# Altium schematic sheet 24V_Buck_3_3V.SchDoc
size A; SheetNumber: 9; SheetTotal: 10
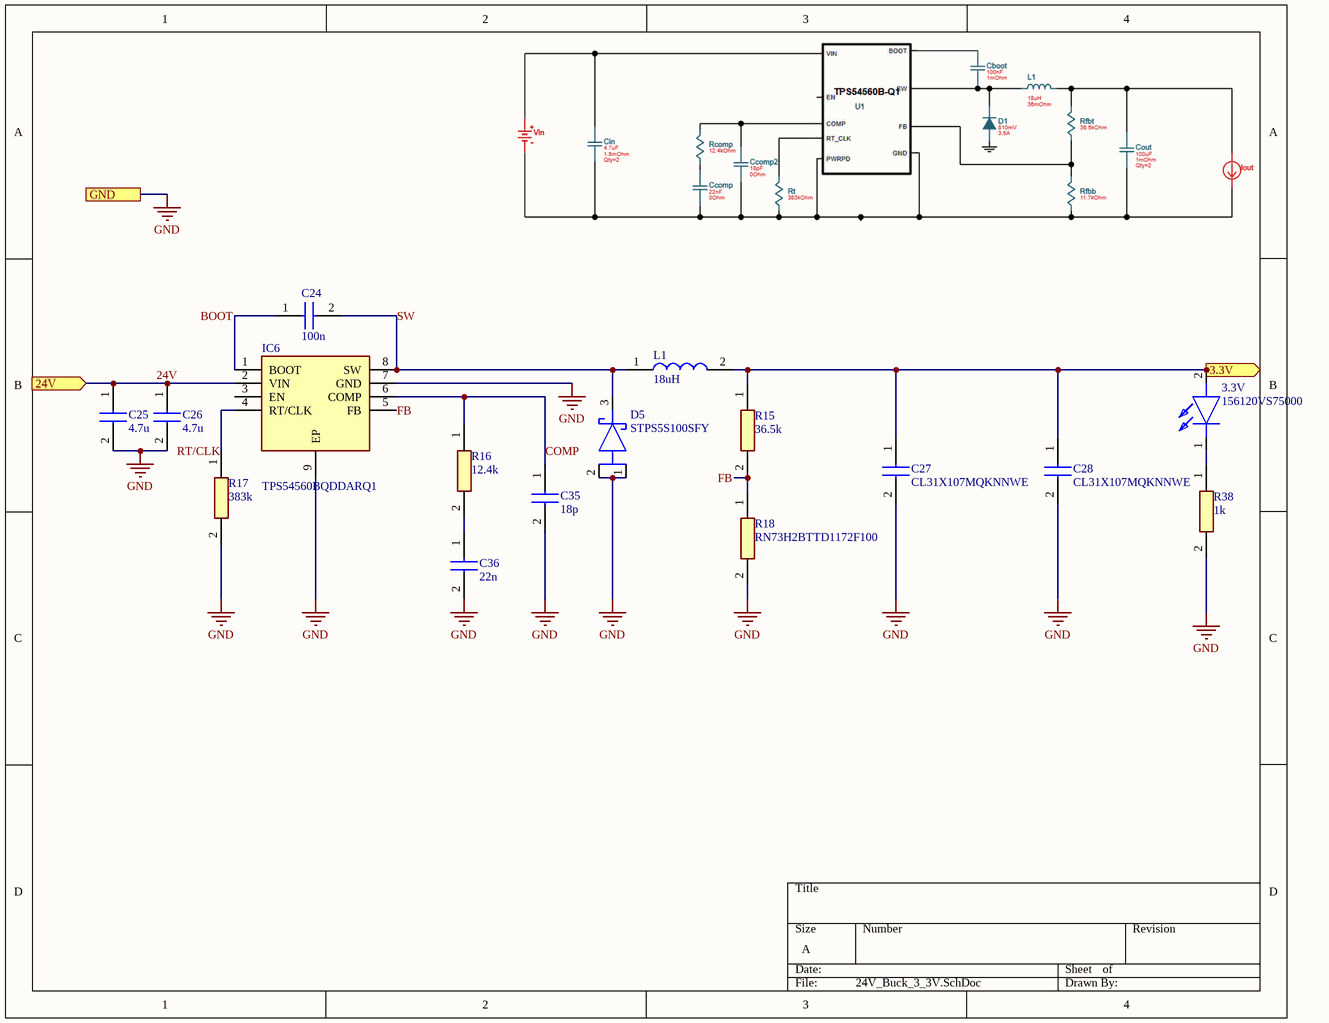
[diagram p0: 24V_Buck_3_3V.SchDoc]

## Parts
3.3V  156120VS75000  [156120VS75000]
C24  100n  [CAPC3216X94N]
C25  4.7u  [CAPC3216X180N]
C26  4.7u  [CAPC3216X180N]
C27  CL31X107MQKNNWE  [CAPC3216X190N]
C28  CL31X107MQKNNWE  [CAPC3216X190N]
C35  18p  [C1206]
C36  22n  [CAPC3216X170N]
D5  STPS5S100SFY  [STPS10L40CSF]
IC6  TPS54560BQDDARQ1  [SOIC127P600X170-9N]
L1  18uH  [INDPM125125X800N]
R15  36.5k  [RESC3116X65N]
R16  12.4k  [ERJUP6]
R17  383k  [RESC3216X70N]
R18  RN73H2BTTD1172F100  [RESC3216X70N]
R38  1k  [RESC3116X65N]

## Ports
3.3V (out), 24V (in), GND

## Nets
GND: C25.2 C26.2 C27.2 C28.2 C35.2 C36.2 D5.1(A1) D5.2(A2) IC6.7(GND) IC6.9(EP) R17.2 R18.2 R38.2 ; port GND
3.3V: 3.3V.2(A) C27.1 C28.1 L1.2 R15.1 ; port 3.3V
24V: C25.1 C26.1 IC6.2(VIN) ; port 24V
BOOT: C24.1 IC6.1(BOOT)
COMP: C35.1 IC6.6(COMP) R16.1
FB: IC6.5(FB) R15.2 R18.1
RT/CLK: IC6.4(RT/CLK) R17.1
SW: C24.2 D5.3(K) IC6.8(SW) L1.1
Net3.3V_1: 3.3V.1(K) R38.1
NetC36_1: C36.1 R16.2

Not connected (* = marked no-connect by the designer): IC6 3(EN)

## Library data of the parts
3.3V = 156120VS75000: LED; Manufacturer_Name: Wurth Elektronik; Datasheet Link: https://www.we-online.com/components/products/datasheet/156120VS75000.pdf; Height: 1.3mm; Manufacturer_Part_Number: 156120VS75000; Mouser Part Number: 710-156120VS75000; Mouser Price/Stock: https://www.mouser.co.uk/ProductDetail/Wurth-Elektronik/156120VS75000?qs=2kOmHSv6VfQAUFg5BeuEfQ%3D%3D
C24 = 12065C104J4Z2A: Capacitor; Manufacturer_Name: Kyocera AVX; Datasheet Link: https://spicat.kyocera-avx.com/product/mlcc/chartview/12065C104J4Z2A/DataSheet/X7R; Height: 0.94mm; Manufacturer_Part_Number: 12065C104J4Z2A; Mouser Part Number: 581-12065C104J4Z2A; Mouser Price/Stock: https://www.mouser.com/Search/Refine.aspx?Keyword=581-12065C104J4Z2A
C25 C26 = GMK316AB7475KLHT: Capacitor; Manufacturer_Name: TAIYO YUDEN; Datasheet Link: https://ds.yuden.co.jp/TYCOMPAS/ap/specSheet?pn=MMASG31LAB7475KTNA01; Height: 1.8mm; Manufacturer_Part_Number: GMK316AB7475KLHT; Mouser Part Number: 963-GMK316AB7475KLHT; Mouser Price/Stock: https://www.mouser.co.uk/ProductDetail/TAIYO-YUDEN/GMK316AB7475KLHT?qs=CNQs48zzdnoeKLJ9%2F6WNWQ%3D%3D; Arrow Part Number: GMK316AB7475KLHT; Arrow Price/Stock: https://www.arrow.com/en/products/gmk316ab7475klht/taiyo-yuden?utm_currency=USD&region=nac
C27 C28 = CL31X107MQKNNWE: Capacitor; Manufacturer_Name: SAMSUNG; Datasheet Link: https://www.digikey.sg/en/products/detail/samsung-electro-mechanics/CL31X107MQKNNWE/25854287?srsltid=AfmBOoqYZ52GRQ9Xlh8bi0lGOe-KtDJ1wz9-WyaigKcCVSEueXc8l4on; Height: 1.9mm; Manufacturer_Part_Number: CL31X107MQKNNWE; Mouser Part Number: 187-CL31X107MQKNNWE; Mouser Price/Stock: https://www.mouser.co.uk/ProductDetail/Samsung-Electro-Mechanics/CL31X107MQKNNWE?qs=Jm2GQyTW%2FbjTv%252BH%2F%252BndEuA%3D%3D
C35 = C1206C180FGGACTU: Capacitor; Manufacturer_Name: KEMET; Datasheet Link: https://content.kemet.com/datasheets/KEM_C1009_C0G_HV_SMD.pdf; Manufacturer_Part_Number: C1206C180FGGACTU
C36 = VJ1206Y223KXBAC: Capacitor; Manufacturer_Name: Vishay; Datasheet Link: http://www.vishay.com/docs/45200/vjhirelseries.pdf; Height: 1.7mm; Manufacturer_Part_Number: VJ1206Y223KXBAC; Mouser Part Number: 77-VJ1206Y223KXBAC; Mouser Price/Stock: https://www.mouser.co.uk/ProductDetail/Vishay-Vitramon/VJ1206Y223KXBAC?qs=DS7Z8uEdLNy5V8LiZ3YDHg%3D%3D
D5 = STPS5S100SFY: Schottky Diode with Dual Anode; Manufacturer_Name: STMicroelectronics; Datasheet Link: https://www.st.com/resource/en/datasheet/stps5s100sfy.pdf; Height: 1.2mm; Manufacturer_Part_Number: STPS5S100SFY; Mouser Part Number: 511-STPS5S100SFY; Mouser Price/Stock: https://www.mouser.co.uk/ProductDetail/STMicroelectronics/STPS5S100SFY?qs=IS%252B4QmGtzzqXirfVtJ7lSA%3D%3D
IC6 = TPS54560BQDDARQ1: Integrated Circuit; Manufacturer_Name: Texas Instruments; Datasheet Link: http://www.ti.com/lit/gpn/tps54560b-q1; Height: 1.7mm; Manufacturer_Part_Number: TPS54560BQDDARQ1; Mouser Part Number: 595-TPS54560BQDDARQ1; Mouser Price/Stock: https://www.mouser.co.uk/ProductDetail/Texas-Instruments/TPS54560BQDDARQ1?qs=Mv7BduZupUi0AsDfghsxzg%3D%3D; Arrow Part Number: TPS54560BQDDARQ1; Arrow Price/Stock: https://www.arrow.com/en/products/tps54560bqddarq1/texas-instruments?utm_currency=USD&region=nac
L1 = SRR1280-180M: Inductor; Manufacturer_Name: Bourns; Datasheet Link: https://www.bourns.com/docs/Product-Datasheets/SRR1280.pdf; Height: 8mm; Manufacturer_Part_Number: SRR1280-180M; Mouser Part Number: 652-SRR1280-180M; Mouser Price/Stock: https://www.mouser.co.uk/ProductDetail/Bourns/SRR1280-180M?qs=brMhP%2FMjUfeRcSm%2FRxSrFQ%3D%3D; Arrow Part Number: SRR1280-180M; Arrow Price/Stock: https://www.arrow.com/en/products/srr1280-180m/bourns?region=nac
R15 = CRCW120636K5FKEAHP: Resistor; Manufacturer_Name: Vishay; Height: 0.65mm; Manufacturer_Part_Number: CRCW120636K5FKEAHP; Mouser Part Number: 71-CRCW120636K5FKEAH; Mouser Price/Stock: https://www.mouser.co.uk/ProductDetail/Vishay-Dale/CRCW120636K5FKEAHP?qs=VAB4DzKv5wUp%2FbasZHay7w%3D%3D; Arrow Part Number: CRCW120636K5FKEAHP; Arrow Price/Stock: https://www.arrow.com/en/products/crcw120636k5fkeahp/vishay?region=nac
R16 = ERJ-UP6F1242V: Resistor; Manufacturer_Name: Panasonic; Datasheet Link: https://industrial.panasonic.com/cdbs/www-data/pdf/RDP0000/AOA0000C337.pdf; Height: 0.7mm; Manufacturer_Part_Number: ERJ-UP6F1242V; Mouser Part Number: 667-ERJ-UP6F1242V; Mouser Price/Stock: https://www.mouser.co.uk/ProductDetail/Panasonic/ERJ-UP6F1242V?qs=dbcCsuKDzFVg0bvXpJGfbQ%3D%3D
R17 = ERA-8AEB3833V: Resistor; Manufacturer_Name: Panasonic; Datasheet Link: https://industrial.panasonic.com/cdbs/www-data/pdf/RDM0000/AOA0000C307.pdf; Height: 0.7mm; Manufacturer_Part_Number: ERA-8AEB3833V
R18 = RN73H2BTTD1172F100: Resistor; Manufacturer_Name: KOA Speer; Datasheet Link: https://www.koaspeer.com/pdfs/RN73H.pdf; Height: 0.7mm; Manufacturer_Part_Number: RN73H2BTTD1172F100; Mouser Part Number: 660-RN73H2BT1172F100; Mouser Price/Stock: https://www.mouser.co.uk/ProductDetail/KOA-Speer/RN73H2BTTD1172F100?qs=egkD4cx1ihS0KaGLrT%2FVSQ%3D%3D
R38 = CRGS1206J1K0: Resistor; Manufacturer_Name: TE Connectivity; Datasheet Link: https://www.te.com/commerce/DocumentDelivery/DDEController?Action=srchrtrv&DocNm=9-1773463-8&DocType=Data%20Sheet&DocLang=English&PartCntxt=3-2176245-7&DocFormat=pdf; Height: 0.65mm; Manufacturer_Part_Number: CRGS1206J1K0; Mouser Part Number: 279-CRGS1206J1K0; Mouser Price/Stock: https://www.mouser.com/Search/Refine.aspx?Keyword=279-CRGS1206J1K0